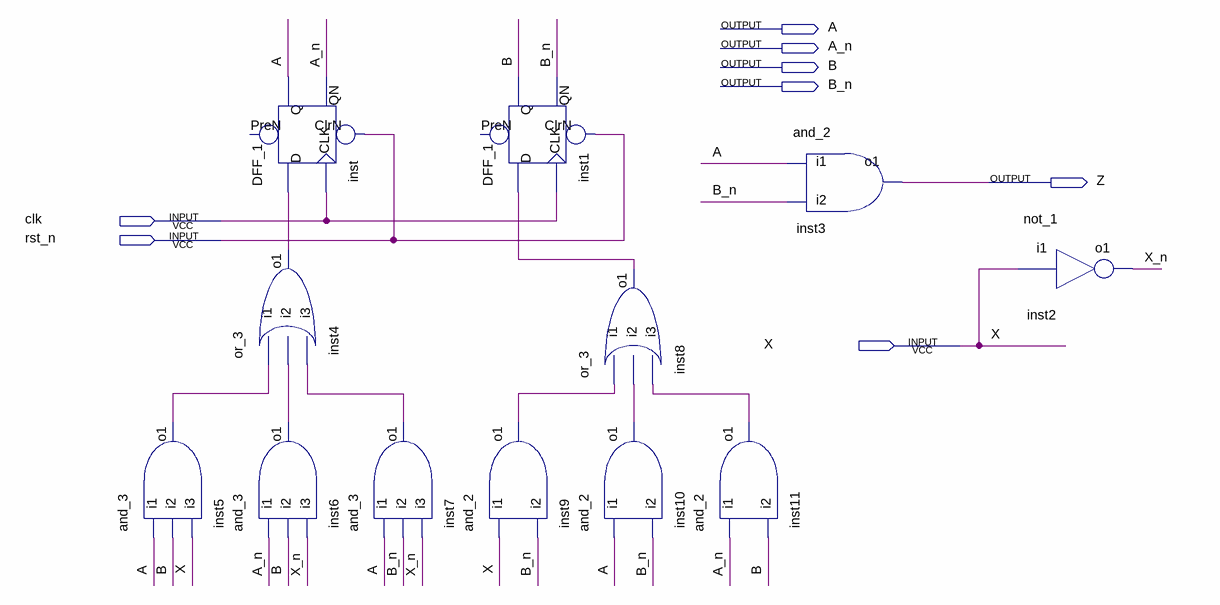
[diagram p0: schematic sheet]
// Quartus schematic 101Detector.bdf as structural Verilog: 12 symbols, 8 pins
module \101Detector  (
  input  clk,
  input  rst_n,
  input  X,
  output A,
  output A_n,
  output B,
  output B_n,
  output Z
);

  wire inst4_o1, inst5_o1, inst6_o1, inst7_o1, inst8_o1, inst9_o1, inst10_o1, inst11_o1, X_n;

  and_3 inst5 (.i1(A), .i2(B), .i3(X), .o1(inst5_o1));
  or_3 inst4 (.i1(inst5_o1), .i2(inst6_o1), .i3(inst7_o1), .o1(inst4_o1));
  and_3 inst6 (.i1(A_n), .i2(B), .i3(X_n), .o1(inst6_o1));
  DFF_1 inst (.CLK(clk), .D(inst4_o1), .ClrN(rst_n), .QN(A_n), .Q(A));  // open: PreN
  and_3 inst7 (.i1(A), .i2(B_n), .i3(X_n), .o1(inst7_o1));
  and_2 inst9 (.i1(X), .i2(B_n), .o1(inst9_o1));
  DFF_1 inst1 (.CLK(clk), .D(inst8_o1), .ClrN(rst_n), .QN(B_n), .Q(B));  // open: PreN
  or_3 inst8 (.i1(inst9_o1), .i2(inst10_o1), .i3(inst11_o1), .o1(inst8_o1));
  and_2 inst10 (.i1(A), .i2(B_n), .o1(inst10_o1));
  and_2 inst11 (.i1(A_n), .i2(B), .o1(inst11_o1));
  and_2 inst3 (.i1(A), .i2(B_n), .o1(Z));
  not_1 inst2 (.i1(X), .o1(X_n));
endmodule
